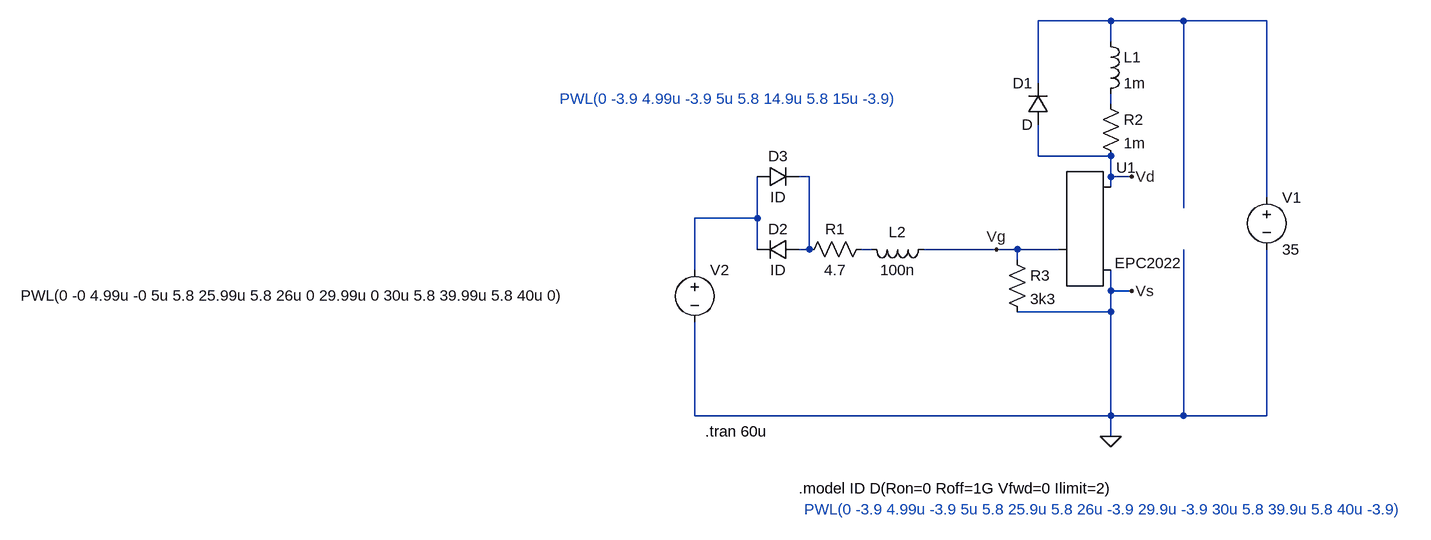
[diagram p0: schematic DPT_EPC2022 - Kopie.asc]
DPT_EPC2022 - Kopie.asc, the LTspice schematic file:
Version 4
SHEET 1 880 680
WIRE -48 -176 -160 -176
WIRE 64 -176 -48 -176
WIRE 192 -176 64 -176
WIRE -48 -144 -48 -176
WIRE -160 -80 -160 -176
WIRE -48 -48 -48 -64
WIRE -160 32 -160 -16
WIRE -48 32 -160 32
WIRE -512 64 -528 64
WIRE -48 64 -48 32
WIRE -16 64 -48 64
WIRE -48 80 -48 64
WIRE 192 96 192 -176
WIRE 64 112 64 -176
WIRE -592 128 -592 64
WIRE -592 128 -688 128
WIRE -592 176 -592 128
WIRE -512 176 -512 64
WIRE -512 176 -528 176
WIRE -416 176 -432 176
WIRE -224 176 -336 176
WIRE -192 176 -224 176
WIRE -128 176 -192 176
WIRE -192 192 -192 176
WIRE -688 208 -688 128
WIRE -48 240 -48 208
WIRE -16 240 -48 240
WIRE -48 272 -48 240
WIRE -48 272 -192 272
WIRE -688 432 -688 288
WIRE -48 432 -48 272
WIRE -48 432 -688 432
WIRE 64 432 64 176
WIRE 64 432 -48 432
WIRE 192 432 192 176
WIRE 192 432 64 432
WIRE -48 464 -48 432
FLAG -16 240 Vs
FLAG -16 64 Vd
FLAG -224 176 Vg
FLAG -48 464 0
SYMBOL EPCGaN -128 176 R0
WINDOW 3 86 21 Left 2
SYMATTR Value EPC2022
SYMATTR InstName U1
SYMBOL res -64 -64 R0
SYMATTR InstName R2
SYMATTR Value 1m
SYMBOL diode -144 -16 R180
WINDOW 0 24 64 Left 2
WINDOW 3 24 0 Left 2
SYMATTR InstName D1
SYMBOL voltage 192 80 R0
WINDOW 123 0 0 Left 0
WINDOW 39 0 0 Left 0
SYMATTR InstName V1
SYMATTR Value 35
SYMBOL voltage -688 192 R0
WINDOW 123 0 0 Left 0
WINDOW 39 0 0 Left 0
WINDOW 3 -1037 55 Left 2
SYMATTR Value PWL(0 -0 4.99u -0 5u 5.8 25.99u 5.8 26u 0 29.99u 0 30u 5.8 39.99u 5.8 40u 0)
SYMATTR InstName V2
SYMBOL ind -64 -160 R0
SYMATTR InstName L1
SYMATTR Value 1m
SYMBOL diode -528 160 R90
WINDOW 0 0 32 VBottom 2
WINDOW 3 32 32 VTop 2
SYMATTR InstName D2
SYMATTR Value ID
SYMBOL diode -592 80 R270
WINDOW 0 32 32 VTop 2
WINDOW 3 0 32 VBottom 2
SYMATTR InstName D3
SYMATTR Value ID
SYMBOL ind -320 160 R90
WINDOW 0 5 56 VBottom 2
WINDOW 3 32 56 VTop 2
SYMATTR InstName L2
SYMATTR Value 100n
SYMBOL res -416 160 R90
WINDOW 0 0 56 VBottom 2
WINDOW 3 32 56 VTop 2
SYMATTR InstName R1
SYMATTR Value 4.7
SYMBOL res -208 176 R0
SYMATTR InstName R3
SYMATTR Value 3k3
TEXT -520 576 Left 2 ;PWL(0 -3.9 4.99u -3.9 5u 5.8 25.9u 5.8 26u -3.9 29.9u -3.9 30u 5.8 39.9u 5.8 40u -3.9)
TEXT -896 -56 Left 2 ;PWL(0 -3.9 4.99u -3.9 5u 5.8 14.9u 5.8 15u -3.9)
TEXT -528 544 Left 2 !.model ID D(Ron=0 Roff=1G Vfwd=0 Ilimit=2)
TEXT -672 456 Left 2 !.tran 60u

The netlist it stands for:
* DPT_EPC2022 - Kopie.asc
XU1 Vg Vd 0 EPC2022
R2 N002 Vd 1m
D1 Vd N001 D
V1 N001 0 35
V2 N004 0 PWL(0 -0 4.99u -0 5u 5.8 25.99u 5.8 26u 0 29.99u 0 30u 5.8 39.99u 5.8 40u 0)
L1 N001 N002 1m
D2 N003 N004 ID
D3 N004 N003 ID
L2 Vg N005 100n
R1 N005 N003 4.7
R3 Vg 0 3k3
.model D D
.lib standard.dio
* PWL(0 -3.9 4.99u -3.9 5u 5.8 25.9u 5.8 26u -3.9 29.9u -3.9 30u 5.8 39.9u 5.8 40u -3.9)
* PWL(0 -3.9 4.99u -3.9 5u 5.8 14.9u 5.8 15u -3.9)
.model ID D(Ron=0 Roff=1G Vfwd=0 Ilimit=2)
.tran 60u
.backanno
.end